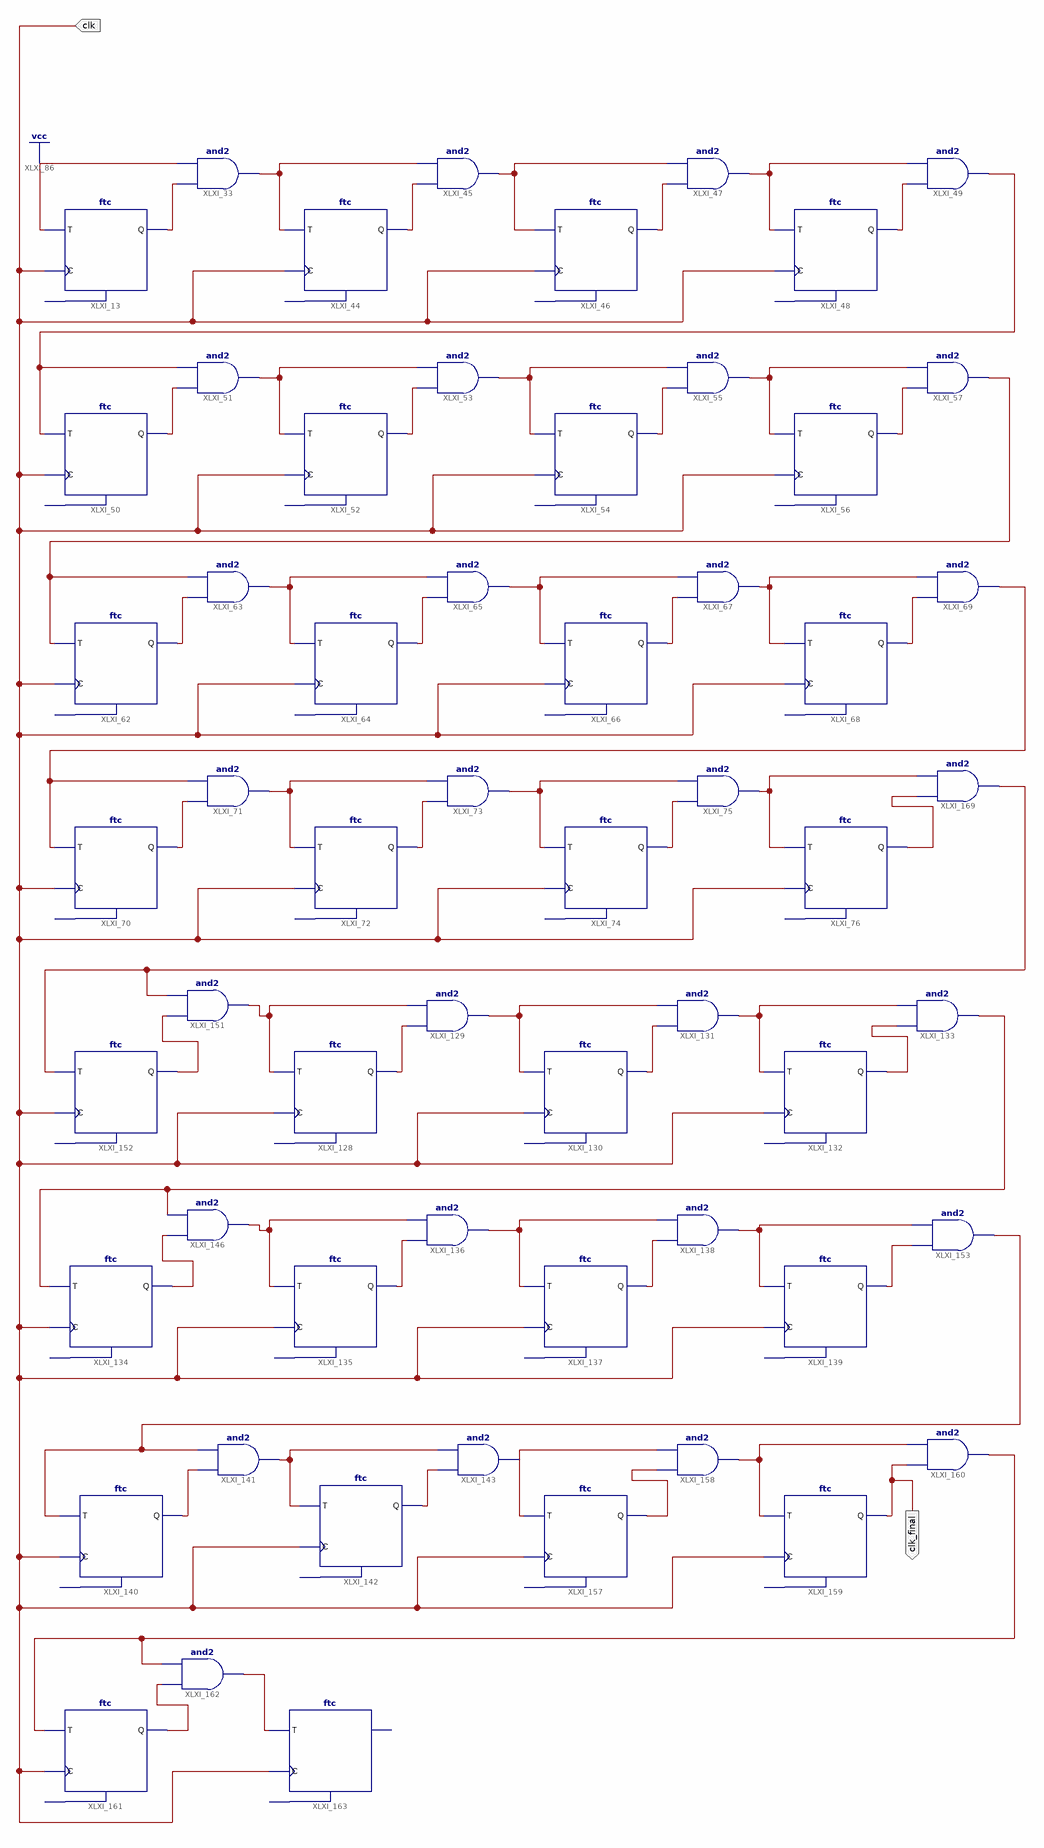
[diagram p0: schematic sheet 1]
// Xilinx ISE schematic Clocking2.sch (artix7) as structural Verilog: 59 symbols, 2 ports
module Clocking2 (
  input  clk,
  output clk_final
);

  wire XLXN_26, XLXN_47, XLXN_49, XLXN_52, XLXN_53, XLXN_55, XLXN_56, XLXN_58, XLXN_59, XLXN_61, XLXN_62,
       XLXN_64, XLXN_65, XLXN_67, XLXN_74, XLXN_76, XLXN_77, XLXN_79, XLXN_80, XLXN_82, XLXN_85, XLXN_86,
       XLXN_88, XLXN_89, XLXN_91, XLXN_92, XLXN_94, XLXN_172, XLXN_184, XLXN_186, XLXN_188, XLXN_190,
       XLXN_192, XLXN_194, XLXN_198, XLXN_200, XLXN_202, XLXN_204, XLXN_206, XLXN_218, XLXN_241, XLXN_249,
       XLXN_252, XLXN_254, XLXN_258, XLXN_261, XLXN_263, XLXN_267, XLXN_272, XLXN_275, XLXN_277, XLXN_287,
       XLXN_291, XLXN_320, XLXN_323, XLXN_325, XLXN_326;

  ftc XLXI_13 (.C(clk), .T(1'b1), .Q(XLXN_26));  // open: CLR
  and XLXI_33 (XLXN_47, XLXN_26, 1'b1);
  ftc XLXI_44 (.C(clk), .T(XLXN_47), .Q(XLXN_49));  // open: CLR
  and XLXI_45 (XLXN_172, XLXN_49, XLXN_47);
  ftc XLXI_46 (.C(clk), .T(XLXN_172), .Q(XLXN_52));  // open: CLR
  and XLXI_47 (XLXN_53, XLXN_52, XLXN_172);
  ftc XLXI_48 (.C(clk), .T(XLXN_53), .Q(XLXN_55));  // open: CLR
  and XLXI_49 (XLXN_56, XLXN_55, XLXN_53);
  ftc XLXI_50 (.C(clk), .T(XLXN_56), .Q(XLXN_58));  // open: CLR
  and XLXI_51 (XLXN_59, XLXN_58, XLXN_56);
  ftc XLXI_52 (.C(clk), .T(XLXN_59), .Q(XLXN_61));  // open: CLR
  and XLXI_53 (XLXN_62, XLXN_61, XLXN_59);
  ftc XLXI_54 (.C(clk), .T(XLXN_62), .Q(XLXN_64));  // open: CLR
  and XLXI_55 (XLXN_65, XLXN_64, XLXN_62);
  ftc XLXI_56 (.C(clk), .T(XLXN_65), .Q(XLXN_67));  // open: CLR
  and XLXI_57 (XLXN_74, XLXN_67, XLXN_65);
  ftc XLXI_62 (.C(clk), .T(XLXN_74), .Q(XLXN_76));  // open: CLR
  and XLXI_63 (XLXN_77, XLXN_76, XLXN_74);
  ftc XLXI_64 (.C(clk), .T(XLXN_77), .Q(XLXN_79));  // open: CLR
  and XLXI_65 (XLXN_80, XLXN_79, XLXN_77);
  ftc XLXI_66 (.C(clk), .T(XLXN_80), .Q(XLXN_82));  // open: CLR
  and XLXI_67 (XLXN_267, XLXN_82, XLXN_80);
  ftc XLXI_68 (.C(clk), .T(XLXN_267), .Q(XLXN_85));  // open: CLR
  and XLXI_69 (XLXN_86, XLXN_85, XLXN_267);
  ftc XLXI_70 (.C(clk), .T(XLXN_86), .Q(XLXN_88));  // open: CLR
  and XLXI_71 (XLXN_89, XLXN_88, XLXN_86);
  ftc XLXI_72 (.C(clk), .T(XLXN_89), .Q(XLXN_91));  // open: CLR
  and XLXI_73 (XLXN_92, XLXN_91, XLXN_89);
  ftc XLXI_74 (.C(clk), .T(XLXN_92), .Q(XLXN_94));  // open: CLR
  and XLXI_75 (XLXN_287, XLXN_94, XLXN_92);
  ftc XLXI_76 (.C(clk), .T(XLXN_287), .Q(XLXN_258));  // open: CLR
  ftc XLXI_128 (.C(clk), .T(XLXN_186), .Q(XLXN_188));  // open: CLR
  and XLXI_129 (XLXN_190, XLXN_188, XLXN_186);
  ftc XLXI_130 (.C(clk), .T(XLXN_190), .Q(XLXN_192));  // open: CLR
  and XLXI_131 (XLXN_194, XLXN_192, XLXN_190);
  ftc XLXI_132 (.C(clk), .T(XLXN_194), .Q(XLXN_291));  // open: CLR
  and XLXI_133 (XLXN_277, XLXN_291, XLXN_194);
  ftc XLXI_134 (.C(clk), .T(XLXN_277), .Q(XLXN_198));  // open: CLR
  ftc XLXI_135 (.C(clk), .T(XLXN_200), .Q(XLXN_202));  // open: CLR
  and XLXI_136 (XLXN_204, XLXN_202, XLXN_200);
  ftc XLXI_137 (.C(clk), .T(XLXN_204), .Q(XLXN_206));  // open: CLR
  and XLXI_138 (XLXN_263, XLXN_206, XLXN_204);
  ftc XLXI_139 (.C(clk), .T(XLXN_263), .Q(XLXN_320));  // open: CLR
  ftc XLXI_140 (.C(clk), .T(XLXN_275), .Q(XLXN_325));  // open: CLR
  and XLXI_141 (XLXN_241, XLXN_325, XLXN_275);
  ftc XLXI_142 (.C(clk), .T(XLXN_241), .Q(XLXN_323));  // open: CLR
  and XLXI_143 (XLXN_218, XLXN_323, XLXN_241);
  and XLXI_158 (XLXN_249, XLXN_326, XLXN_218);
  ftc XLXI_159 (.C(clk), .T(XLXN_249), .Q(clk_final));  // open: CLR
  and XLXI_160 (XLXN_261, clk_final, XLXN_249);
  and XLXI_162 (XLXN_254, XLXN_252, XLXN_261);
  ftc XLXI_163 (.C(clk), .T(XLXN_254));  // open: CLR, Q
  and XLXI_169 (XLXN_272, XLXN_258, XLXN_287);
  and XLXI_151 (XLXN_186, XLXN_184, XLXN_272);
  ftc XLXI_152 (.C(clk), .T(XLXN_272), .Q(XLXN_184));  // open: CLR
  and XLXI_153 (XLXN_275, XLXN_320, XLXN_263);
  ftc XLXI_161 (.C(clk), .T(XLXN_261), .Q(XLXN_252));  // open: CLR
  and XLXI_146 (XLXN_200, XLXN_198, XLXN_277);
  ftc XLXI_157 (.C(clk), .T(XLXN_218), .Q(XLXN_326));  // open: CLR
endmodule
